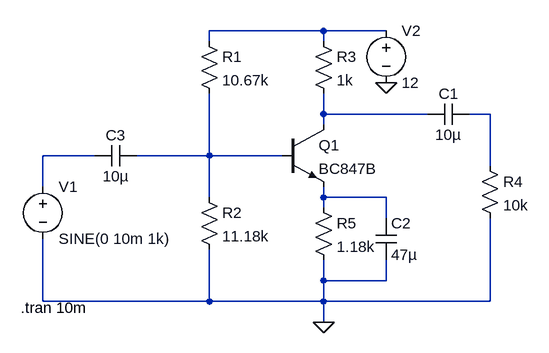
[diagram p0: schematic ce_amplifier.asc]
ce_amplifier.asc, the LTspice schematic file:
Version 4
SHEET 1 880 680
WIRE 256 0 80 0
WIRE 352 0 256 0
WIRE 80 16 80 0
WIRE 256 16 256 0
WIRE 256 128 256 96
WIRE 416 128 256 128
WIRE 512 128 480 128
WIRE 256 144 256 128
WIRE -96 192 -176 192
WIRE 80 192 80 96
WIRE 80 192 -32 192
WIRE 192 192 80 192
WIRE 512 208 512 128
WIRE -176 240 -176 192
WIRE 80 256 80 192
WIRE 256 256 256 240
WIRE 352 256 256 256
WIRE 256 272 256 256
WIRE 352 288 352 256
WIRE 256 384 256 352
WIRE 352 384 352 352
WIRE 352 384 256 384
WIRE -176 416 -176 320
WIRE 80 416 80 336
WIRE 80 416 -176 416
WIRE 256 416 256 384
WIRE 256 416 80 416
WIRE 512 416 512 288
WIRE 512 416 256 416
WIRE 256 448 256 416
FLAG 256 448 0
FLAG 352 80 0
SYMBOL npn 192 144 R0
SYMATTR InstName Q1
SYMATTR Value BC847B
SYMBOL res 64 0 R0
SYMATTR InstName R1
SYMATTR Value 10.67k
SYMBOL res 64 240 R0
SYMATTR InstName R2
SYMATTR Value 11.18k
SYMBOL res 240 0 R0
SYMATTR InstName R3
SYMATTR Value 1k
SYMBOL res 496 192 R0
SYMATTR InstName R4
SYMATTR Value 10k
SYMBOL res 240 256 R0
SYMATTR InstName R5
SYMATTR Value 1.18k
SYMBOL voltage -176 224 R0
WINDOW 123 0 0 Left 0
WINDOW 39 0 0 Left 0
SYMATTR InstName V1
SYMATTR Value SINE(0 10m 1k)
SYMBOL voltage 352 -16 R0
WINDOW 123 0 0 Left 0
WINDOW 39 0 0 Left 0
SYMATTR InstName V2
SYMATTR Value 12
SYMBOL cap 416 144 R270
WINDOW 0 32 32 VTop 2
WINDOW 3 0 32 VBottom 2
SYMATTR InstName C1
SYMATTR Value 10µ
SYMBOL cap 336 288 R0
SYMATTR InstName C2
SYMATTR Value 47µ
SYMBOL cap -96 208 R270
WINDOW 0 32 32 VTop 2
WINDOW 3 0 32 VBottom 2
SYMATTR InstName C3
SYMATTR Value 10µ
TEXT -210 426 Left 2 !.tran 10m

The netlist it stands for:
* ce_amplifier.asc
Q1 N002 N005 N006 0 BC847B
R1 N001 N005 10.67k
R2 N005 0 11.18k
R3 N001 N002 1k
R4 N003 0 10k
R5 N006 0 1.18k
V1 N004 0 SINE(0 10m 1k)
V2 N001 0 12
C1 N002 N003 10µ
C2 N006 0 47µ
C3 N004 N005 10µ
.model NPN NPN
.model PNP PNP
.lib standard.bjt
.tran 10m
.backanno
.end